# EAGLE design ChannelOutput (EAGLE 6.5.0)
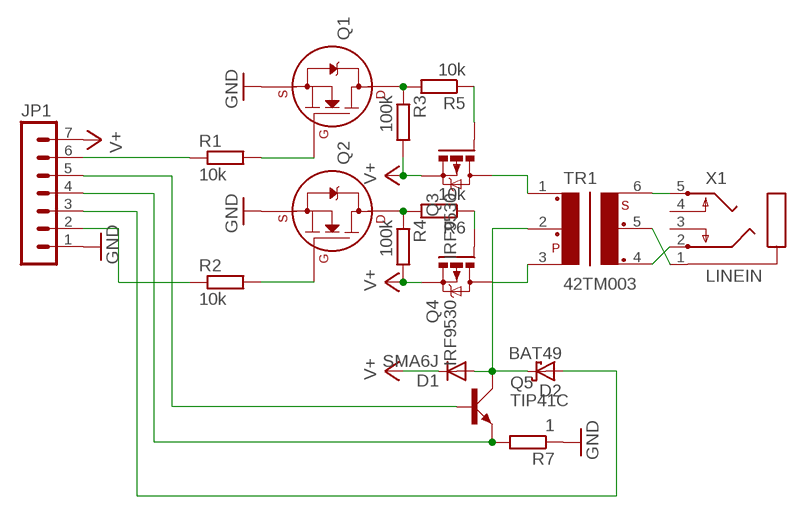
[diagram p0: schematic, sheet 1]

## Parts
D1  SMA6J  1N4004  [DO41-10]
D2  BAT49  [DO41-10]
JP1  MA07-1  [MA07-1]
Q1  2N7000_TO92  [TO-92]
Q2  2N7000_TO92  [TO-92]
Q3  IRF9530  [TO220BV]
Q4  IRF9530  [TO220BV]
Q5  TIP41C  [TO220AV]
R1  10k  R-EU_0207/2V  [0207/2V]
R2  10k  R-EU_0207/2V  [0207/2V]
R3  100k  R-EU_0204/5  [0204/5]
R4  100k  R-EU_0204/5  [0204/5]
R5  10k  R-EU_0207/2V  [0207/2V]
R6  10k  R-EU_0207/2V  [0207/2V]
R7  1  R-EU_0207/2V  [0207/2V]
TR1  42TM003  [42TM]
X1  LINEIN  PG203J  [PG203J]

## Nets
GND: JP1.1 Q1.1(S) Q2.1(S) R7.1
N$1: Q1.2(G) R1.2
N$2: Q4.G R6.1
N$3: JP1.2 R2.1
N$4: JP1.6 R1.1
N$5: Q4.D TR1.3
N$6: Q3.D TR1.1
N$7: D2.A JP1.3
N$14: JP1.4 Q5.E R7.2
N$48: D1.A D2.C Q5.C TR1.2
N$65: TR1.6 X1.5
N$66: TR1.5 X1.1
N$67: TR1.4 X1.2
N$86: Q2.3(D) R4.1 R6.2
N$88: Q3.G R5.1
N$89: Q1.3(D) R3.1 R5.2
N$93: Q2.2(G) R2.2
N$98: JP1.5 Q5.B
V+: D1.C JP1.7 Q3.S Q4.S R3.2 R4.2
Unconnected: X1.3 X1.4

## Library data of the parts
D1 = diode:1N4004: DIODE general purpose rectifier, 1 A
D2 = diode:BAT49: DIODE small signal diode
JP1 = con-lstb:MA07-1: PIN HEADER; OC_FARNELL: unknown; OC_NEWARK: unknown
Q1 Q2 = transistors2:2N700*: 2N7000, 2N7002, NDS7002A N-channel enhancement mode MOSFET
Q3 Q4 = transistor-power:IRF9530: P-CHANNEL HEXFET POWER-MOS-FET Source: http://www.irf.com/product-info/datasheets/data/irf9530.pdf
Q5 = transistor-power:TIP41C: NPN TRANSISTOR
R1-R7 = resistor:R-EU_: RESISTOR, European symbol
TR1 = trafo-xicon:42T?*: Xicon Micro-Mini EI-12 Audio Transformers 42TL/42TC/42TM Series Source: http://www.mouser.com//catalog/specsheets/164201.pdf http://www.mouser.com/catalog/specsheets/114225.pdf http://www.mouser.com/catalog/specsheets/164267.pdf; OC_FARNELL: unknown; OC_NEWARK: unknown
X1 = con-hirschmann:PG203J: MIC/HEADPHONE JACK KS-S stereo microphone/headphone jack PG203JN (Schukat); OC_FARNELL: unknown; OC_NEWARK: unknown

## Net classes
0 default: width 0.305 mm, clearance 0.205 mm

## Board
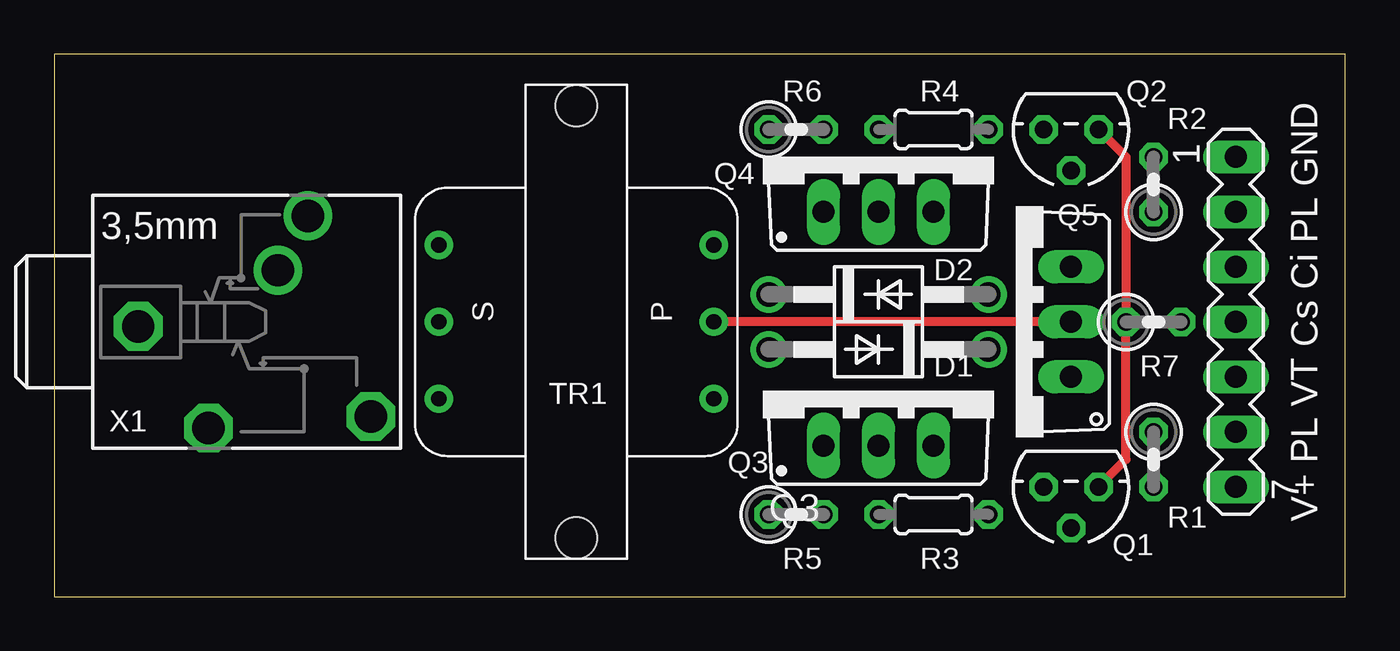
[diagram p1: board, top side]
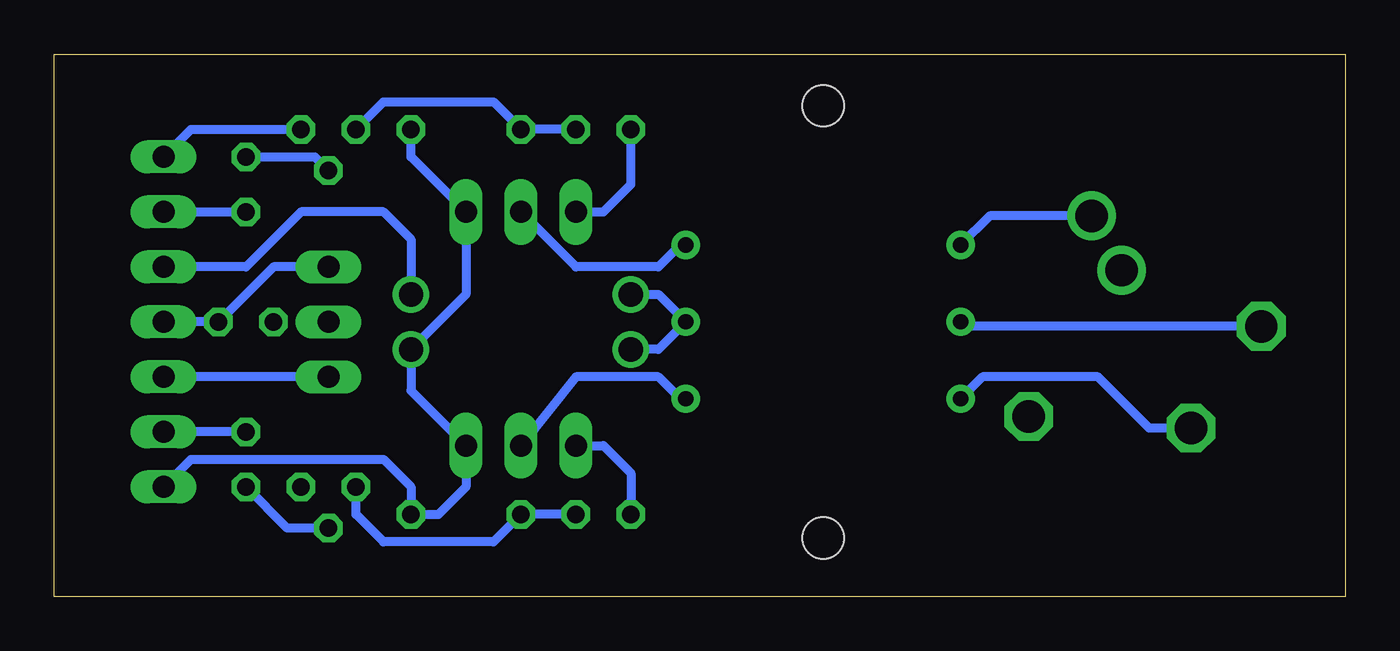
[diagram p2: board, bottom side, seen from below]

Size 59.67 x 25.07 mm. Coordinates in mm from the lower left corner, seen from the top.
Outline: 0,0 59.67,0 59.67,25.07 0,25.07 0,0
Copper layers (1*16): Top 0.035mm / dielectric 1.5mm / Bottom 0.035mm
Design rules "default": minimum track width 10mil, minimum drill 24mil, track to track 8mil, track to pad 8mil, pad to pad 8mil, via to via 8mil, smd to smd 8mil, copper to edge 40mil, drill to drill 8mil, minimum pad ring 10mil, minimum via ring 8mil, stop-mask expansion 4mil, vias tented up to drill 0mil, thermal gap 10mil

### Footprints (pad centres in the part's own frame; a part is rotated, then mirrored left to right if it is on the bottom)
DO41-10 = drill 1.118: A 5.08,0; C -5.08,0
MA07-1 = drill 1.016 long: 1 -7.62,0; 2 -5.08,0; 3 -2.54,0; 4 0,0; 5 2.54,0; 6 5.08,0; 7 7.62,0
TO-92 = drill 0.813 octagon: 1 -1.27,0; 2 0,1.905; 3 1.27,0
TO220BV = drill 1.016 long: D 0,-2.54; G -2.54,-2.54; S 2.54,-2.54
TO220AV = drill 1.016 long: B -2.54,-2.54; C 0,-2.54; E 2.54,-2.54
0207/2V = drill 0.813 octagon: 1 -1.27,0; 2 1.27,0
0204/5 = drill 0.813 octagon: 1 -2.54,0; 2 2.54,0
42TM = drill 0.7 pad 1.3: 1 -3.556,-6.35; 2 0,-6.35; 3 3.556,-6.35; 4 3.556,6.35; 5 0,6.35; 6 -3.556,6.35 | hole 1.9: -9.982,0; 9.982,0
PG203J = drill 1.499 octagon: 1 -5.004,-0.203; 4 5.74,-4.369; 5 -1.753,-4.902 | drill 1.499: 2 2.845,4.902; 3 1.448,2.388

### Placement (x,y rotation side)
D1  38.1,11.43 180 top
D2  38.1,13.97 0 top
JP1  54.61,12.7 270 top
Q1  46.99,5.08 180 top
Q2  46.99,21.59 180 top
Q3  38.1,9.52 0 top
Q4  38.1,20.32 0 top
Q5  44.45,12.7 90 top
R1  50.8,6.35 270 top
R2  50.8,19.05 90 top
R3  40.64,3.81 0 top
R4  40.64,21.59 0 top
R5  34.29,3.81 0 top
R6  34.29,21.59 0 top
R7  50.8,12.7 0 top
TR1  24.13,12.7 90 top
X1  8.89,12.7 0 top

### Tracks (layer width: path | path; a pad name or v marks a point on that pad's centre or on a via)
GND
  Top 0.406: Q1.1 49.53,6.35 R7.1 49.53,20.32 Q2.1
  Bottom 0.406: Q2.1 53.34,21.59 JP1.1
N$1
  Bottom 0.406: Q1.2 48.9,3.17 R1.2
N$2
  Bottom 0.406: Q4.G 34.29,17.78 33.02,19.05 R6.1
N$3
  Bottom 0.406: JP1.2 R2.1
N$4
  Bottom 0.406: R1.1 JP1.6
N$5
  Bottom 0.406: TR1.3 30.73,16.26 31.75,15.24 35.56,15.24 Q4.D
N$6
  Bottom 0.406: TR1.1 30.73,9.14 31.75,10.16 35.56,10.16 Q3.D
N$7
  Bottom 0.406: D2.A 43.18,16.51 44.45,17.78 48.26,17.78 50.8,15.24 JP1.3
N$14
  Bottom 0.406: Q5.E 49.53,15.24 R7.2 JP1.4
N$48
  Top 0.406: Q5.C TR1.2
  Bottom 0.406: D2.C 31.75,13.97 TR1.2 31.75,11.43 D1.A
N$65
  Bottom 0.406: X1.5 9.07,7.8 11.43,10.16 16.76,10.16 TR1.6
N$66
  Bottom 0.406: X1.1 17.58,12.5 TR1.5
N$67
  Bottom 0.406: X1.2 16.43,17.6 TR1.4
N$86
  Bottom 0.406: R6.2 R4.1 39.37,22.86 44.45,22.86 Q2.3
N$88
  Bottom 0.406: 33.02,4.45 R5.1 33.02,5.72 34.29,6.99 Q3.G
N$89
  Bottom 0.406: R5.2 R3.1 39.37,2.54 44.45,2.54 45.72,3.81 Q1.3
N$93
  Bottom 0.406: Q2.2 47.62,20.32 R2.2
N$98
  Bottom 0.406: Q5.B JP1.5
V+
  Bottom 0.406: R4.2 43.18,20.32 Q4.S 40.64,13.97 D1.C 43.18,9.52 Q3.S 40.64,5.08 41.91,3.81 R3.2 43.18,5.08 44.45,6.35 53.34,6.35 JP1.7

### Text on the board
tNames: R6 | R4 | Q2 | V+ PL VT Cs Ci PL GND | R2 | Q4 | Q5 | D2 | D1 | R7 | TR1 | X1 | Q3 | R1 | R5 | R3 | Q1